# Altium schematic sheet psu_temp.SchDoc
size A4
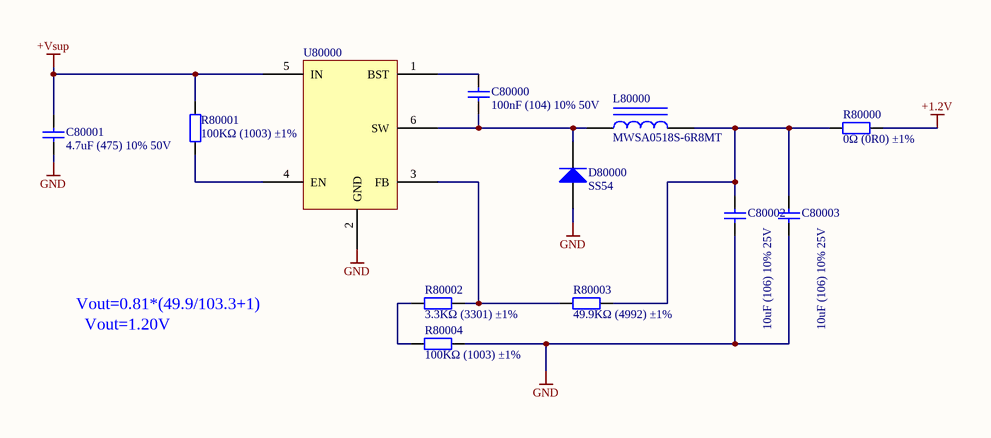
[diagram p0: psu_temp.SchDoc]

## Parts
C80000  100nF (104) 10% 50V  [0603_C]
C80001  4.7uF (475) 10% 50V  [1206_C]
C80002  10uF (106) 10% 25V  [0805_C]
C80003  10uF (106) 10% 25V  [0805_C]
D80000  SS54  [SMA(DO-214AC)_S1]
L80000  MWSA0518S-6R8MT  [MWSA0518]
R80000  0Ω (0R0) ±1%  [0805_R]
R80001  100KΩ (1003) ±1%  [0402_R]
R80002  3.3KΩ (3301) ±1%  [0402_R]
R80003  49.9KΩ (4992) ±1%  [0402_R]
R80004  100KΩ (1003) ±1%  [0402_R]
U80000  STEP-DOWN CONVERTER  [*TSOT-23_S6]  (value not drawn)

## Nets
+1.2V: R80000.2
+Vsup: C80001.2 R80001.2 U80000.5(IN)
GND: C80001.1 C80002.1 C80003.1 D80000.1(A) R80004.1 U80000.2(GND)
NetC80000_1: C80000.1 D80000.2(K) L80000.1 U80000.6(SW)
NetC80000_2: C80000.2 U80000.1(BST)
NetC80002_2: C80002.2 C80003.2 L80000.2 R80000.1 R80003.2
NetR80001_1: R80001.1 U80000.4(EN)
NetR80002_1: R80002.1 R80003.1 U80000.3(FB)
NetR80002_2: R80002.2 R80004.2

## Notes on the sheet
- Vout=1.20V
- Vout=0.81*(49.9/103.3+1)

## Library data of the parts
C80000 = 0603 100nF (104) 10% 50V: 贴片电容; ComponentLink1Description: 供应商链接; ComponentLink1URL: http://www.szlcsc.com/product/details_15331.html; Package: 0603; Supplier: LC; SuppliersPartNumber: C14663
C80001 = 1206 4.7uF (475) 10% 50V: 贴片电容; ComponentLink1Description: 供应商链接; ComponentLink1URL: http://www.szlcsc.com/product/details_30577.html; Package: 1206; Supplier: LC; SuppliersPartNumber: C29823
C80002 C80003 = 0805 10uF (106) 10% 25V: 贴片电容; ComponentLink1Description: 供应商链接; ComponentLink1URL: http://www.szlcsc.com/product/details_16532.html; Package: 0805; Supplier: LC; SuppliersPartNumber: C15850
D80000 = SMA(DO-214AC) SS54: 二极管; ComponentLink1Description: 供应商链接; ComponentLink1URL: http://www.szlcsc.com/product/details_23178.html; Package: SMA(DO-214AC); Supplier: LC; SuppliersPartNumber: C22452
L80000 = MWSA0518S-6R8MT: POWER INDUCTORS SMD,5.2X5.4X1.8MM ROHS; Value: 6.8uH; Current Rating: 5.0A; Package: 5.2X5.4X1.8MM; Supplier: LC; SuppliersPartNumber: C408348
R80000 = 0805 0Ω (0R0) 1%: 贴片电阻; ComponentLink1Description: 供应商链接; ComponentLink1URL: http://www.szlcsc.com/product/details_18165.html; Package: 0805; Supplier: LC; SuppliersPartNumber: C17477
R80001 R80004 = 0402 100KΩ (1003) 1%: 贴片电阻; ComponentLink1Description: 供应商链接; ComponentLink1URL: http://www.szlcsc.com/product/details_26484.html; Package: 0402; Supplier: LC; SuppliersPartNumber: C25741
R80002 = 0402 3.3KΩ (3301) 1%: 贴片电阻; ComponentLink1Description: 供应商链接; ComponentLink1URL: http://www.szlcsc.com/product/details_26633.html; Package: 0402; Supplier: LC; SuppliersPartNumber: C25890
R80003 = 0402 49.9KΩ (4992) 1%: 贴片电阻; ComponentLink1Description: 供应商链接; ComponentLink1URL: http://www.szlcsc.com/product/details_26640.html; Package: 0402; Supplier: LC; SuppliersPartNumber: C25897
U80000 = MP2359: 1.2A, 24V, 1.4MHz STEP-DOWN CONVERTER IN A TSOT23-6; SuppliersPartNumber: C14259